# EAGLE design QED_2550_SOLO (EAGLE 6.1)
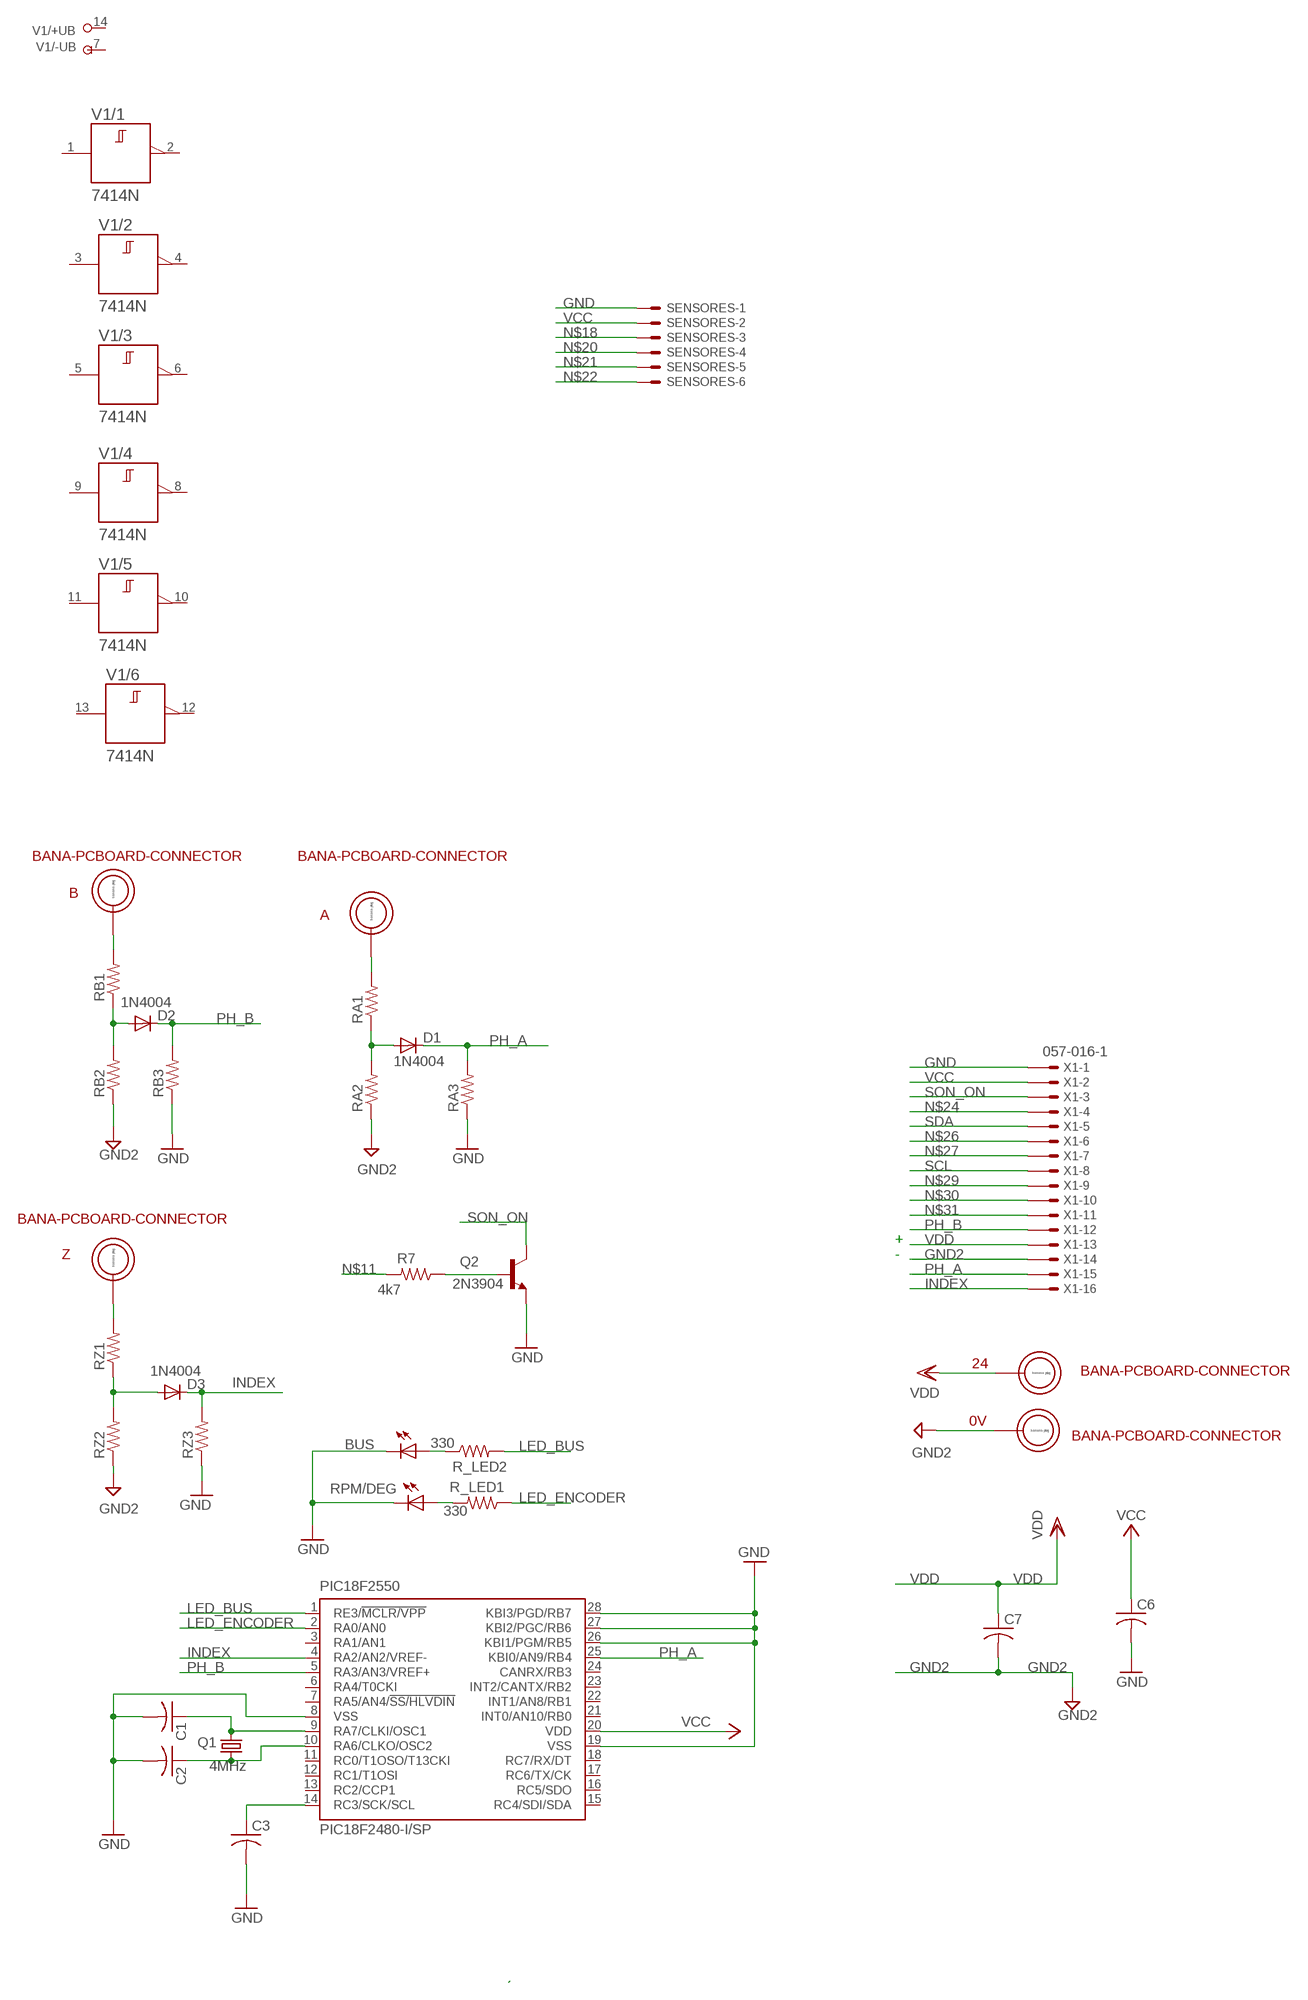
[diagram p0: schematic, sheet 1]

## Parts
0V  BANA-PCBOARD-CONNECTOR  [BANA_PLUG]
24  BANA-PCBOARD-CONNECTOR  [BANA_PLUG]
A  BANA-PCBOARD-CONNECTOR  [BANA_PLUG]
B  BANA-PCBOARD-CONNECTOR  [BANA_PLUG]
BUS  LED5MM  [LED5MM]
C1  C-US025-024X044  [C025-024X044]
C2  C-US025-024X044  [C025-024X044]
C3  C-US025-024X044  [C025-024X044]
C6  C-US025-030X050  [C025-030X050]
C7  C-US025-030X050  [C025-030X050]
D1  1N4004  [DO41-10]
D2  1N4004  [DO41-10]
D3  1N4004  [DO41-10]
PIC18F2550  PIC18F2480-I/SP  [DIL28-3]
Q1  4MHz  CRYSTALHC49S  [HC49/S]
Q2  2N3904  [TO92]
R7  4k7  R-US_0204/7  [0204/7]
R_LED1  330  R-US_0204/7  [0204/7]
R_LED2  330  R-US_0204/7  [0204/7]
RA1  R-US_0204/7  [0204/7]
RA2  R-US_0204/7  [0204/7]
RA3  R-US_0204/7  [0204/7]
RB1  R-US_0204/7  [0204/7]
RB2  R-US_0204/7  [0204/7]
RB3  R-US_0204/7  [0204/7]
RPM/DEG  LED5MM  [LED5MM]
RZ1  R-US_0204/7  [0204/7]
RZ2  R-US_0204/7  [0204/7]
RZ3  R-US_0204/7  [0204/7]
SENSORES  22-23-2061  [22-23-2061]
V1  7414N  [DIL14]
X1  057-016-1  [057-016-1]
Z  BANA-PCBOARD-CONNECTOR  [BANA_PLUG]

## Nets
GND: BUS.K(C) C1.2 C2.2 C3.2 C6.2 PIC18F2550.8(VSS) PIC18F2550.19(VSS) PIC18F2550.26(KBI1/PGM/RB5) PIC18F2550.27(KBI2/PGC/RB6) PIC18F2550.28(KBI3/PGD/RB7) Q2.3(E) RA3.1 RB3.1 RPM/DEG.K(C) RZ3.1 SENSORES.1 X1.1
GND2: 0V.P$1 C7.2 RA2.1 RB2.1 RZ2.1 X1.14
INDEX: D3.C PIC18F2550.4(RA2/AN2/VREF-) RZ3.2 X1.16
LED_BUS: PIC18F2550.1(RE3/!MCLR/VPP) R_LED2.2
LED_ENCODER: PIC18F2550.2(RA0/AN0) R_LED1.1
N$1: C1.1 PIC18F2550.9(RA7/CLKI/OSC1) Q1.2
N$2: C2.1 PIC18F2550.10(RA6/CLKO/OSC2) Q1.1
N$3: C3.1 PIC18F2550.14(RC3/SCK/SCL)
N$5: BUS.A R_LED2.1
N$7: R_LED1.2 RPM/DEG.A
N$8: D1.A RA1.1 RA2.2
N$9: Q2.2(B) R7.1
N$10: D2.A RB1.1 RB2.2
N$11: R7.2
N$12: RZ1.2 Z.P$1
N$16: B.P$1 RB1.2
N$17: A.P$1 RA1.2
N$18: SENSORES.3
N$19: D3.A RZ1.1 RZ2.2
N$20: SENSORES.4
N$21: SENSORES.5
N$22: SENSORES.6
N$24: X1.4
N$26: X1.6
N$27: X1.7
N$29: X1.9
N$30: X1.10
N$31: X1.11
PH_A: D1.C PIC18F2550.25(KBI0/AN9/RB4) RA3.2 X1.15
PH_B: D2.C PIC18F2550.5(RA3/AN3/VREF+) RB3.2 X1.12
SCL: X1.8
SDA: X1.5
SON_ON: Q2.1(C) X1.3
VCC: C6.1 PIC18F2550.20(VDD) SENSORES.2 X1.2
VDD: 24.P$1 C7.1 X1.13
Unconnected: PIC18F2550.3(RA1/AN1) PIC18F2550.6(RA4/T0CKI) PIC18F2550.7(RA5/AN4/!SS/HLVDIN) PIC18F2550.11(RC0/T1OSO/T13CKI) PIC18F2550.12(RC1/T1OSI) PIC18F2550.13(RC2/CCP1) PIC18F2550.15(RC4/SDI/SDA) PIC18F2550.16(RC5/SDO) PIC18F2550.17(RC6/TX/CK) PIC18F2550.18(RC7/RX/DT) PIC18F2550.21(INT0/AN10/RB0) PIC18F2550.22(INT1/AN8/RB1) PIC18F2550.23(INT2/CANTX/RB2) PIC18F2550.24(CANRX/RB3) V1.1(/1:A) V1.2(/1:Y) V1.3(/2:A) V1.4(/2:Y) V1.5(/3:A) V1.6(/3:Y) V1.8(/4:Y) V1.9(/4:A) V1.10(/5:Y) V1.11(/5:A) V1.12(/6:Y) V1.13(/6:A)

## Notes on the sheet
- +
- -

## Power pins joined to a net without a drawn wire
+UB: V1.14(/+UB:+UB)
-UB: V1.7(/-UB:-UB)

## Library data of the parts
0V 24 A B Z = banana-plug:BANA-PCBOARD-CONNECTOR: Banana Plug to PC Board connector
BUS RPM/DEG = led:LED: LED OSRAM: - CHIPLED LG R971, LG N971, LY N971, LG Q971, LY Q971, LO R971, LY R971 LH N974, LH R974 LS Q976, LO Q976, LY Q976 LO Q996 - Hyper CHIPLED LW Q18S LB Q993, LB Q99A, LB R99A - SideLED LS A670, LO A670, LY A670, LG A670, LP A670 LB A673, LV A673, LT A673, LW A673 LH A674 LY A675 LS A676, LA A676, LO A676, LY A676, LW A676 LS A679, LY A679, LG A679 - Hyper Micro SIDELED® LS Y876, LA Y876, LO Y876, LY Y876 LT Y87S - SmartLED LW L88C, LW L88S LB L89C, LB L89S, LG L890 LS L89K, LO L89K, LY L89K LS L896, LA L896, LO L896, LY L896 - TOPLED LS T670, LO T670, LY T670, LG T670, LP T670 LSG T670, LSP T670, LSY T670, LOP T670, LYG T670 LG T671, LOG T671, LSG T671 LB T673, LV T673, LT T673, LW T673 LH T674 LS T676, LA T676, LO T676, LY T676, LB T676, LH T676, LSB T676, LW T676 LB T67C, LV T67C, LT T67C, LS T67K, LO T67K, LY T67K, LW E67C LS E67B, LA E67B, LO E67B, LY E67B, LB E67C, LV E67C, LT E67C LW T67C LS T679, LY T679, LG T679 LS T770, LO T770, LY T770, LG T770, LP T770 LB T773, LV T773, LT T773, LW T773 LH T774 LS E675, LA E675, LY E675, LS T675 LS T776, LA T776, LO T776, LY T776, LB T776 LHGB T686 LT T68C, LB T68C - Hyper Mini TOPLED® LB M676 - Mini TOPLED Santana® LG M470 LS M47K, LO M47K, LY M47K Source: http://www.osram.convergy.de LUXEON: - LUMILED® LXK2-PW12-R00, LXK2-PW12-S00, LXK2-PW14-U00, LXK2-PW14-V00 LXK2-PM12-R00, LXK2-PM12-S00, LXK2-PM14-U00 LXK2-PE12-Q00, LXK2-PE12-R00, LXK2-PE12-S00, LXK2-PE14-T00, LXK2-PE14-U00 LXK2-PB12-K00, LXK2-PB12-L00, LXK2-PB12-M00, LXK2-PB14-N00, LXK2-PB14-P00, LXK2-PB14-Q00 LXK2-PR12-L00, LXK2-PR12-M00, LXK2-PR14-Q00, LXK2-PR14-R00 LXK2-PD12-Q00, LXK2-PD12-R00, LXK2-PD12-S00 LXK2-PH12-R00, LXK2-PH12-S00 LXK2-PL12-P00, LXK2-PL12-Q00, LXK2-PL12-R00 Source: www.luxeon.com KINGBRIGHT: KA-3528ASYC Source: www.kingbright.com
C1-C3 C6 C7 = rcl:C-US: CAPACITOR, American symbol
D1-D3 = diode:1N4004: DIODE general purpose rectifier, 1 A
PIC18F2550 = microchip:PIC18F2*80: 28-Pin Enhanced Flash Microcontrollers with ECAN(TM) Technology 10-Bit A/D and nanoWatt Technology Source: http://www.microchip.com .. 39637a.pdf; MF: MICROCHIP; MPN: PIC18F2480-I/SP; OC_FARNELL: 9321217; OC_NEWARK: 71J7237
Q1 = crystal:CRYSTAL: CRYSTAL; OC_FARNELL: 1667008; OC_NEWARK: unknown
Q2 = -redpic-diode-transistor:2N3904: NPN Transistor
R7 R_LED1 R_LED2 RA1-RA3 RB1-RB3 RZ1-RZ3 = rcl:R-US_: RESISTOR, American symbol
SENSORES = con-molex:22-23-2061: .100" (2.54mm) Center Header - 6 Pin; MF: MOLEX; MPN: 22-23-2061; OC_FARNELL: 1462922; OC_NEWARK: 27C1933
V1 = 74ttl-din:74*14: Hex schmitt trigger INVERTER
X1 = con-panduit:057-016-: CONNECTOR 10-pin series 057 contact pc board low profile headers; OC_FARNELL: unknown; OC_NEWARK: unknown

## Board
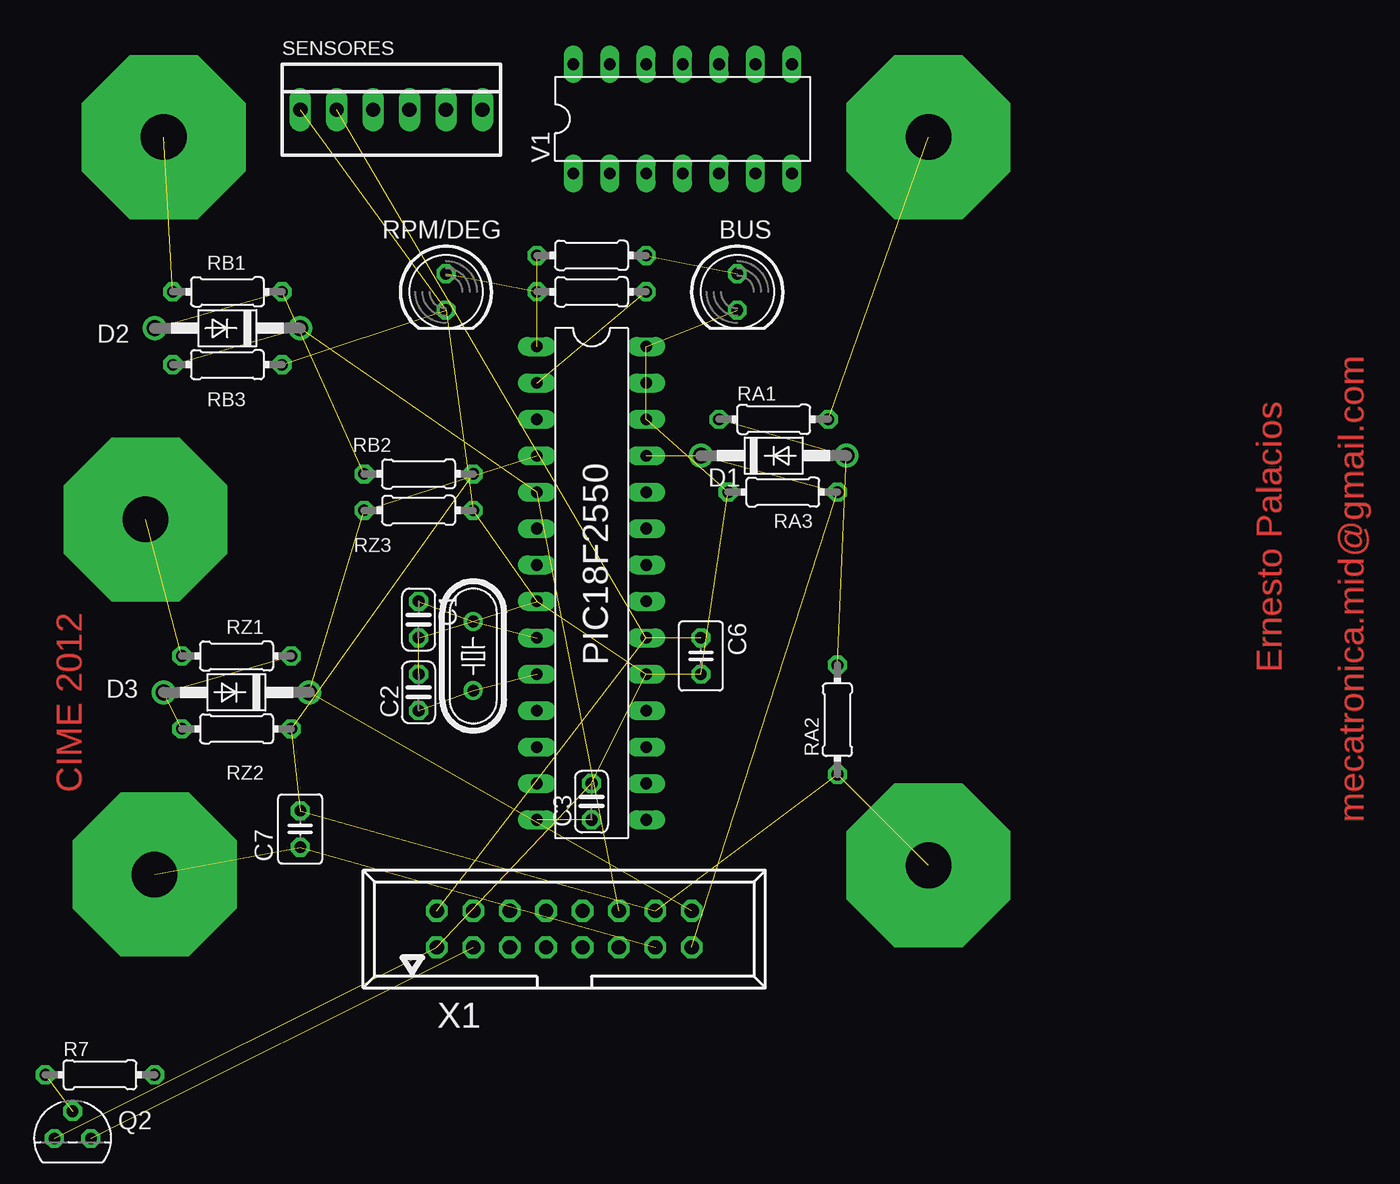
[diagram p1: board, top side]
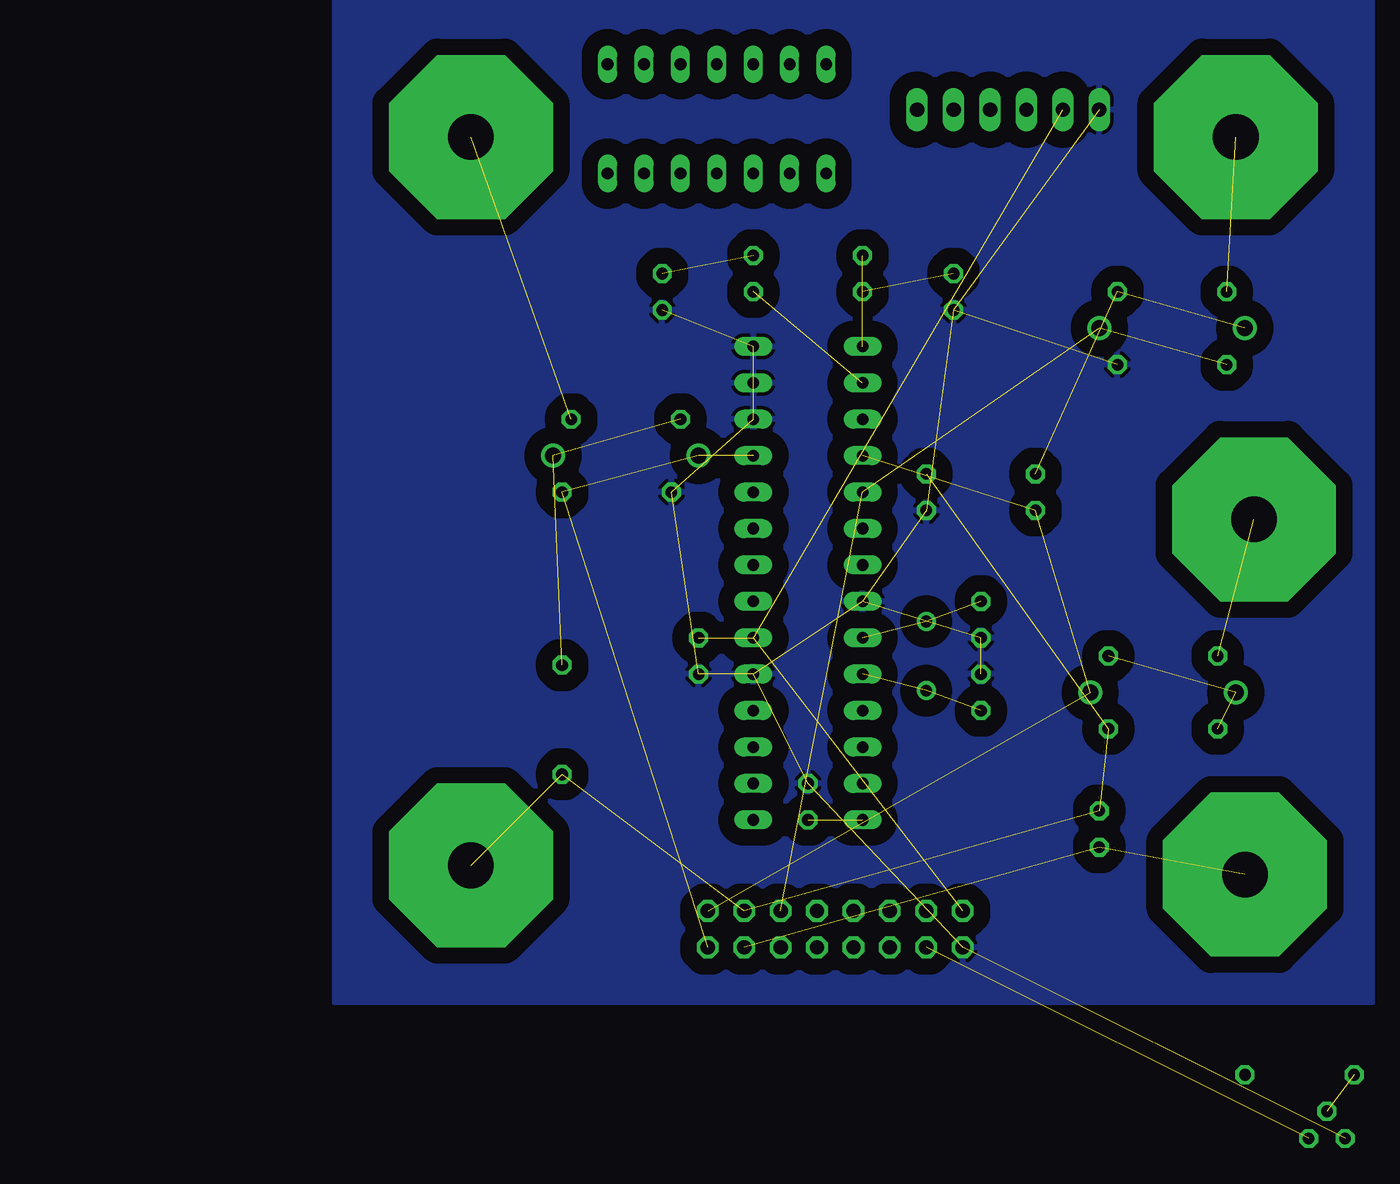
[diagram p2: board, bottom side, seen from below]

No outline drawn. Coordinates in mm, seen from the top.
Copper layers (1*16): Top 0.035mm / dielectric 1.5mm / Bottom 0.035mm
Design rules: minimum track width 10mil, minimum drill 24mil, track to track 45mil, track to pad 45mil, pad to pad 45mil, via to via 45mil, smd to smd 45mil, copper to edge 40mil, drill to drill 8mil, minimum pad ring 10mil, minimum via ring 8mil, stop-mask expansion 4mil, vias tented up to drill 0mil, thermal gap 10mil

### Footprints (pad centres in the part's own frame; a part is rotated, then mirrored left to right if it is on the bottom)
BANA_PLUG = drill 3.175 pad 11.43 octagon: P$1 0,0
LED5MM = drill 0.813 octagon: A -1.27,0; K 1.27,0
C025-024X044 = drill 0.813 octagon: 1 -1.27,0; 2 1.27,0
C025-030X050 = drill 0.813 octagon: 1 -1.27,0; 2 1.27,0
DO41-10 = drill 1.118: A 5.08,0; C -5.08,0
DIL28-3 = drill 0.813 long: 1 -16.51,-3.81; 2 -13.97,-3.81; 3 -11.43,-3.81; 4 -8.89,-3.81; 5 -6.35,-3.81; 6 -3.81,-3.81; 7 -1.27,-3.81; 8 1.27,-3.81; 9 3.81,-3.81; 10 6.35,-3.81; 11 8.89,-3.81; 12 11.43,-3.81; 13 13.97,-3.81; 14 16.51,-3.81; 15 16.51,3.81; 16 13.97,3.81; 17 11.43,3.81; 18 8.89,3.81; 19 6.35,3.81; 20 3.81,3.81; 21 1.27,3.81; 22 -1.27,3.81; 23 -3.81,3.81; 24 -6.35,3.81; 25 -8.89,3.81; 26 -11.43,3.81; 27 -13.97,3.81; 28 -16.51,3.81
HC49/S = drill 0.813: 1 -2.413,0; 2 2.413,0
TO92 = drill 0.813 octagon: 1 1.27,0; 2 0,1.905; 3 -1.27,0
0204/7 = drill 0.813 octagon: 1 -3.81,0; 2 3.81,0
22-23-2061 = drill 1 long: 1 -6.35,0; 2 -3.81,0; 3 -1.27,0; 4 1.27,0; 5 3.81,0; 6 6.35,0
DIL14 = drill 0.813 long: 1 -7.62,-3.81; 2 -5.08,-3.81; 3 -2.54,-3.81; 4 0,-3.81; 5 2.54,-3.81; 6 5.08,-3.81; 7 7.62,-3.81; 8 7.62,3.81; 9 5.08,3.81; 10 2.54,3.81; 11 0,3.81; 12 -2.54,3.81; 13 -5.08,3.81; 14 -7.62,3.81
057-016-1 = drill 1 octagon: 1 -8.89,-1.27; 2 -8.89,1.27; 3 -6.35,-1.27; 4 -6.35,1.27; 5 -3.81,-1.27; 6 -3.81,1.27; 7 -1.27,-1.27; 8 -1.27,1.27; 9 1.27,-1.27; 10 1.27,1.27; 11 3.81,-1.27; 12 3.81,1.27; 13 6.35,-1.27; 14 6.35,1.27; 15 8.89,-1.27; 16 8.89,1.27

### Placement (x,y rotation side)
0V  64.14,9.53 0 top
24  10.16,8.89 0 top
A  64.14,60.33 0 top
B  10.79,60.33 0 top
BUS  50.8,49.53 270 top
C1  28.57,26.67 270 top
C2  28.57,21.59 90 top
C3  40.64,13.97 90 top
C6  48.26,24.13 270 top
C7  20.32,12.06 90 top
D1  53.34,38.1 0 top
D2  15.24,46.99 180 top
D3  15.88,21.59 180 top
PIC18F2550  40.64,29.21 270 top
Q1  32.38,24.13 90 top
Q2  4.45,-9.53 0 top
R7  6.35,-5.08 0 top
R_LED1  40.64,49.53 180 top
R_LED2  40.64,52.07 180 top
RA1  53.34,40.64 0 top
RA2  57.78,19.68 90 top
RA3  53.98,35.56 0 top
RB1  15.24,49.53 180 top
RB2  28.57,36.83 180 top
RB3  15.24,44.45 180 top
RPM/DEG  30.48,49.53 270 top
RZ1  15.88,24.13 180 top
RZ2  15.88,19.05 180 top
RZ3  28.57,34.29 180 top
SENSORES  26.67,62.23 0 top
V1  46.99,61.59 0 top
X1  38.73,5.08 0 top
Z  9.53,33.66 0 top

### Tracks (layer width: path | path; a pad name or v marks a point on that pad's centre or on a via)
GND  (16 unrouted)
  pour Bottom: 1.27,0 1.27,69.85 73.66,69.85 73.66,0
GND2  (5 unrouted)
INDEX  (3 unrouted)
LED_BUS  (1 unrouted)
LED_ENCODER  (1 unrouted)
N$1  (2 unrouted)
N$2  (2 unrouted)
N$3  (1 unrouted)
N$5  (1 unrouted)
N$7  (1 unrouted)
N$8  (2 unrouted)
N$9  (1 unrouted)
N$10  (2 unrouted)
N$12  (1 unrouted)
N$16  (1 unrouted)
N$17  (1 unrouted)
N$19  (2 unrouted)
PH_A  (3 unrouted)
PH_B  (3 unrouted)
SON_ON  (1 unrouted)
VCC  (3 unrouted)
VDD  (2 unrouted)

### Text on the board
Top: mecatronica.mid@gmail.com | Ernesto Palacios | CIME 2012